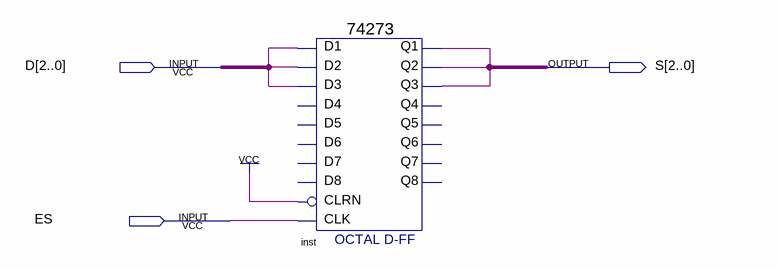
[diagram p0: schematic sheet]
// Quartus schematic RI - RegistradorInstrucoes.bdf as structural Verilog: 1 symbols, 3 pins
module \RI_-_RegistradorInstrucoes  (
  input  [2:0] D,
  input  ES,
  output [2:0] S
);

  wire inst_q1, undriven;

  \74273  inst (
    .D2(undriven), .D3(undriven), .D1(undriven), .CLK(ES), .CLRN(1'b1), .Q1(inst_q1), .Q2(inst_q1),
    .Q3(inst_q1));  // open: D4, D7, D6, D5, D8, Q4, Q6, Q5, Q7, Q8
endmodule
